# Altium schematic sheet UI_CCU_HAS.SchDoc: CCU - User Interface
size B; DrawnBy: M. Seago; Organization: Gravitas; Address1: Sponsored By:; Address2: Alan Morgan; Address3: Technical Advisor:; Address4: Dr. Joseph Morgan; Revision: 1A; SheetNumber: 3; SheetTotal: 9
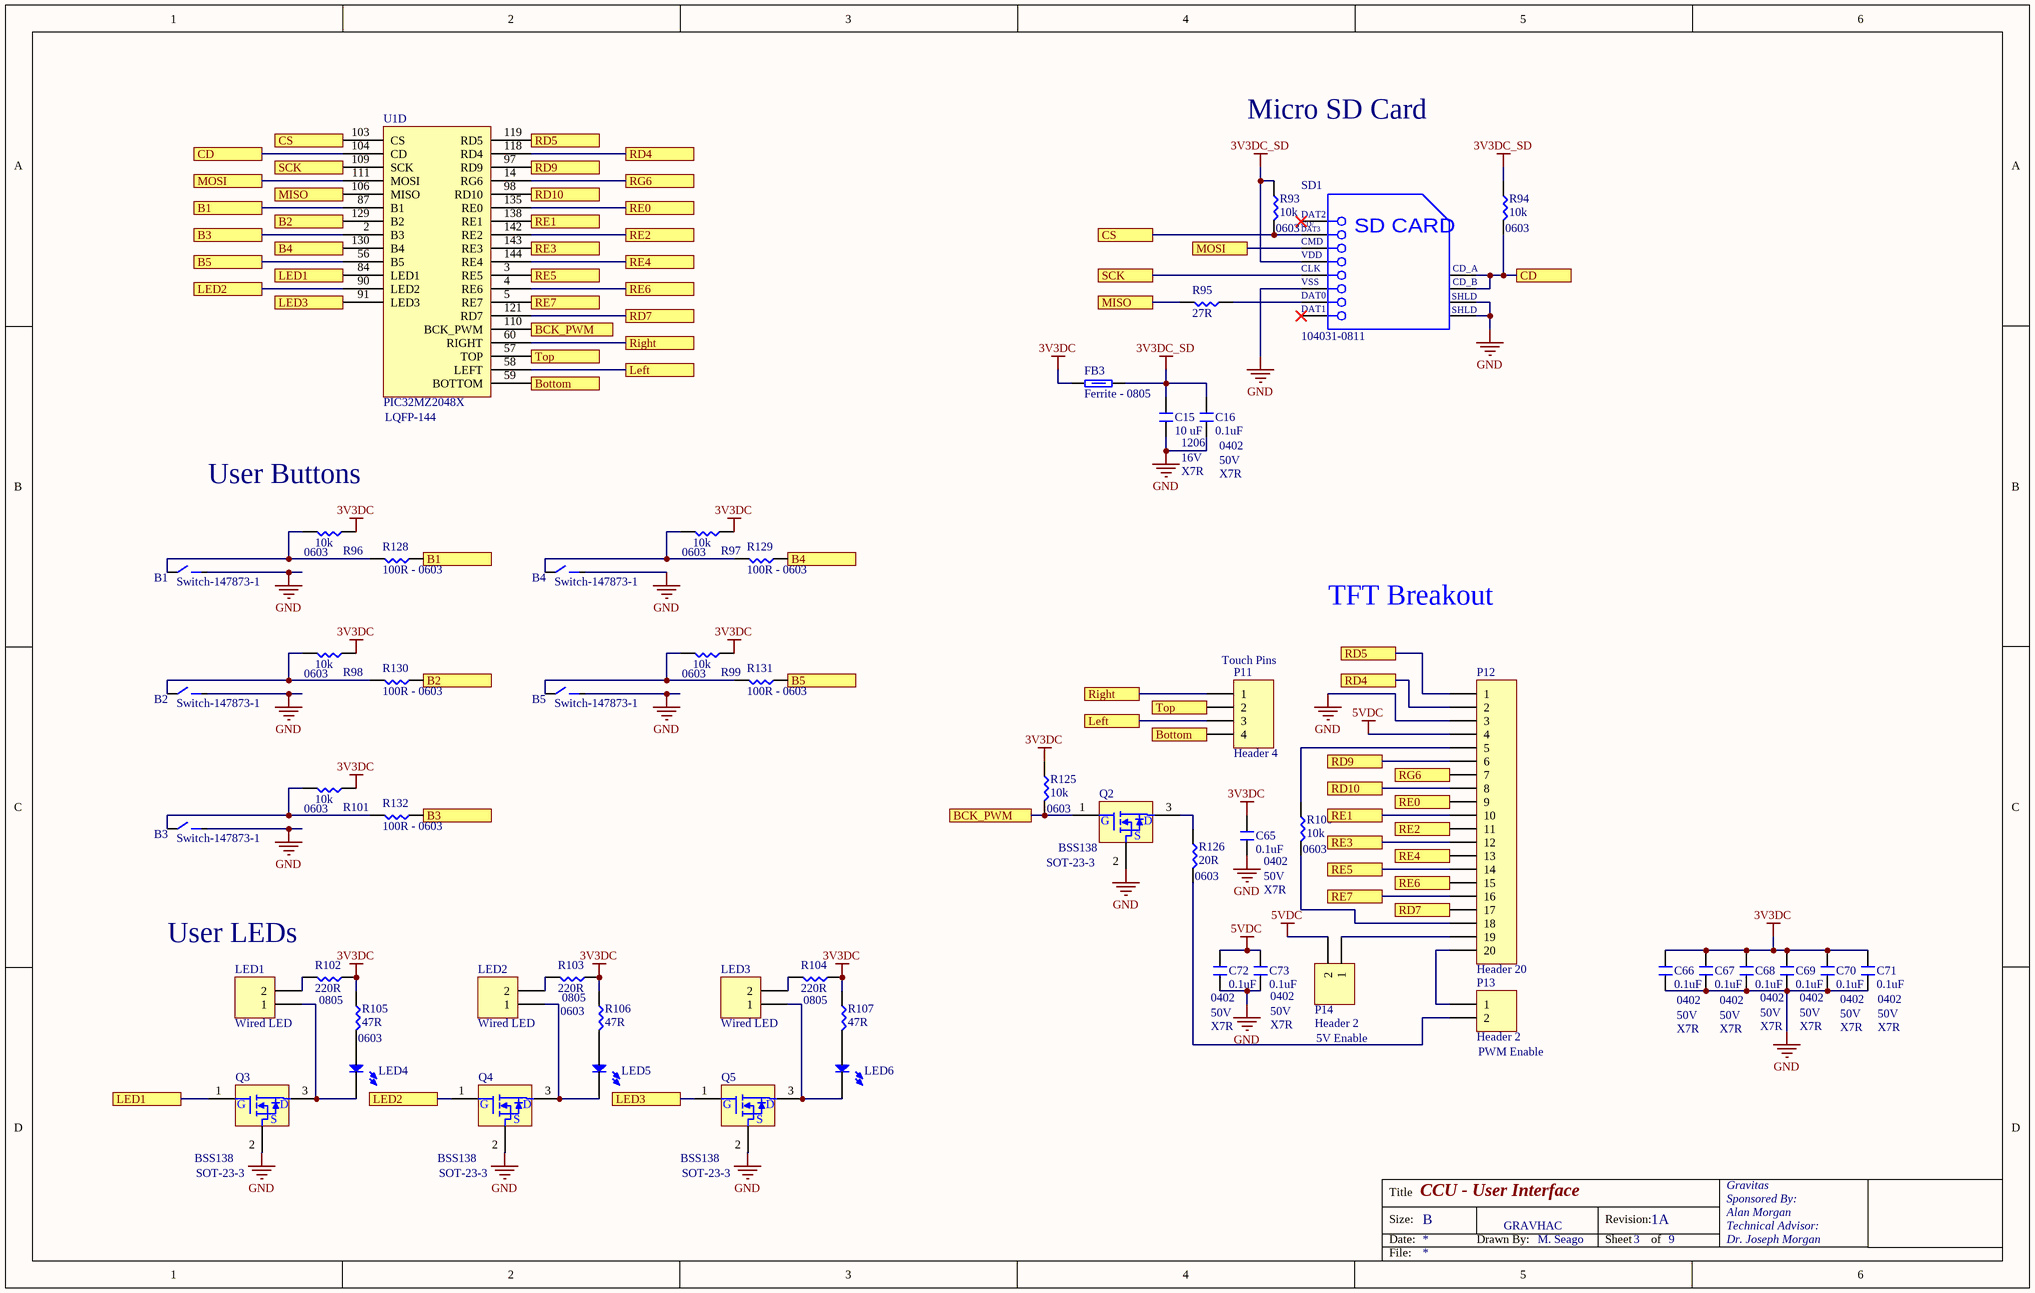
[diagram p0: UI_CCU_HAS.SchDoc]

## Parts
B1  Switch-147873-1  [Switch - 147873-1]
B2  Switch-147873-1  [Switch - 147873-1]
B3  Switch-147873-1  [Switch - 147873-1]
B4  Switch-147873-1  [Switch - 147873-1]
B5  Switch-147873-1  [Switch - 147873-1]
C15  10 uF  [NONPOLAR-1206]
C16  0.1uF  [NonPolar-0402]
C65  0.1uF  [NonPolar-0402]
C66  0.1uF  [NonPolar-0402]
C67  0.1uF  [NonPolar-0402]
C68  0.1uF  [NonPolar-0402]
C69  0.1uF  [NonPolar-0402]
C70  0.1uF  [NonPolar-0402]
C71  0.1uF  [NonPolar-0402]
C72  0.1uF  [NonPolar-0402]
C73  0.1uF  [NonPolar-0402]
FB3  Ferrite - 0805  [NonPolar-0805]
LED1  Wired LED  [HDR1X2]
LED2  Wired LED  [HDR1X2]
LED3  Wired LED  [HDR1X2]
LED4  LED-0603  [LED-0603]  (value not drawn)
LED5  LED-0603  [LED-0603]  (value not drawn)
LED6  LED-0603  [LED-0603]  (value not drawn)
P11  Header 4  [HDR1X4]
P12  Header 20  [HDR1X20]
P13  Header 2  [HDR1X2]
P14  Header 2  [HDR1X2]
Q2  BSS138  [BSS138-SOT23]
Q3  BSS138  [BSS138-SOT23]
Q4  BSS138  [BSS138-SOT23]
Q5  BSS138  [BSS138-SOT23]
R93  10k  [NonPolar-0603]
R94  10k  [NonPolar-0603]
R95  27R  [NonPolar-0603]
R96  10k  [NonPolar-0603]
R97  10k  [NonPolar-0603]
R98  10k  [NonPolar-0603]
R99  10k  [NonPolar-0603]
R100  10k  [NonPolar-0603]
R101  10k  [NonPolar-0603]
R102  220R  [NonPolar-0805]
R103  220R  [NonPolar-0805]
R104  220R  [NonPolar-0805]
R105  47R  [NonPolar-0603]
R106  47R  [NonPolar-0603]
R107  47R  [NonPolar-0603]
R125  10k  [NonPolar-0603]
R126  20R  [NonPolar-0603]
R128  100R - 0603  [NonPolar-0603]
R129  100R - 0603  [NonPolar-0603]
R130  100R - 0603  [NonPolar-0603]
R131  100R - 0603  [NonPolar-0603]
R132  100R - 0603  [NonPolar-0603]
SD1  104031-0811  [MOLX-104031-0811_V]
U1  PIC32MZ2048X  [BIG_PIC32MZ]  (part D of 7)

## Ports
B1, B2, B3, B4, B5, BCK_PWM, Bottom, CD, CS, LED1, LED2, LED3, Left, MISO, MOSI, RD4, RD5, RD7, RD9, RD10, RE0, RE1, RE2, RE3, RE4, RE5, RE6, RE7, RG6, Right, SCK, Top

## Nets
3V3DC: C65.2 C66.2 C67.2 C68.2 C69.2 C70.2 C71.2 FB3.1 R96.2 R97.2 R98.2 R99.2 R101.2 R102.2 R103.2 R104.2 R105.2 R106.2 R107.2 R125.2
3V3DC_SD: C15.2 C16.2 FB3.2 R93.2 R94.2 SD1.4(VDD)
5VDC: C72.2 C73.2 P12.4 P14.2
GND: B1.2 B2.2 B3.2 B4.2 B5.2 C15.1 C16.1 C65.1 C66.1 C67.1 C68.1 C69.1 C70.1 C71.1 C72.1 C73.1 P12.3 Q2.2(S) Q3.2(S) Q4.2(S) Q5.2(S) SD1.6(VSS2) SD1.11(SHLD1) SD1.12(SHLD2)
B1: R128.2 U1.87(B1) ; port B1
B2: R130.2 U1.129(B2) ; port B2
B3: R132.2 U1.2(B3) ; port B3
B4: R129.2 U1.130(B4) ; port B4
B5: R131.2 U1.56(B5) ; port B5
BCK_PWM: Q2.1(G) R125.1 U1.110(BCK_PWM) ; port BCK_PWM
Bottom: P11.4 U1.59(BOTTOM) ; port Bottom
CD: R94.1 SD1.9(CD_A) SD1.10(CD_B) U1.104(CD) ; port CD
CS: R93.1 SD1.2(CMD) U1.103(CS) ; port CS
LED1: Q3.1(G) U1.84(LED1) ; port LED1
LED2: Q4.1(G) U1.90(LED2) ; port LED2
LED3: Q5.1(G) U1.91(LED3) ; port LED3
Left: P11.3 U1.58(LEFT) ; port Left
MISO: R95.1 U1.106(MISO) ; port MISO
MOSI: SD1.3(VSS1) U1.111(MOSI) ; port MOSI
RD4: P12.2 U1.118(RD4) ; port RD4
RD5: P12.1 U1.119(RD5) ; port RD5
RD7: P12.17 U1.121(RD7) ; port RD7
RD9: P12.6 U1.97(RD9) ; port RD9
RD10: P12.8 U1.98(RD10) ; port RD10
RE0: P12.9 U1.135(RE0) ; port RE0
RE1: P12.10 U1.138(RE1) ; port RE1
RE2: P12.11 U1.142(RE2) ; port RE2
RE3: P12.12 U1.143(RE3) ; port RE3
RE4: P12.13 U1.144(RE4) ; port RE4
RE5: P12.14 U1.3(RE5) ; port RE5
RE6: P12.15 U1.4(RE6) ; port RE6
RE7: P12.16 U1.5(RE7) ; port RE7
RG6: P12.7 U1.14(RG6) ; port RG6
Right: P11.1 U1.60(RIGHT) ; port Right
SCK: SD1.5(CLK) U1.109(SCK) ; port SCK
Top: P11.2 U1.57(TOP) ; port Top
NetB1_1: B1.1 R96.1 R128.1
NetB2_1: B2.1 R98.1 R130.1
NetB3_1: B3.1 R101.1 R132.1
NetB4_1: B4.1 R97.1 R129.1
NetB5_1: B5.1 R99.1 R131.1
NetLED1_1: LED1.1 LED4.2 Q3.3(D)
NetLED1_2: LED1.2 R102.1
NetLED2_1: LED2.1 LED5.2 Q4.3(D)
NetLED2_2: LED2.2 R103.1
NetLED3_1: LED3.1 LED6.2 Q5.3(D)
NetLED3_2: LED3.2 R104.1
NetLED4_1: LED4.1 R105.1
NetLED5_1: LED5.1 R106.1
NetLED6_1: LED6.1 R107.1
NetP12_5: P12.5 R100.2
NetP12_18: P12.18 R100.1
NetP12_19: P12.19 P14.1
NetP12_20: P12.20 P13.1
NetP13_2: P13.2 R126.1
NetQ2_3: Q2.3(D) R126.2
NetR95_2: R95.2 SD1.7(DAT0)

Not connected (* = marked no-connect by the designer): SD1 1(CD/DAT3)* 8(DAT1)*

## Notes on the sheet
- Micro SD Card
- (near R93) 0603
- (near R94) 0603
- (near U1) LQFP-144
- (near R96) User Buttons
- 1206
- 16V
- X7R
- (near C16) 0402
- (near C16) 50V
- (near R96) 0603
- (near R97) 0603
- TFT Breakout
- (near R98) 0603
- (near R99) 0603
- (near P11) Touch Pins
- (near R101) 0603
- (near R125) 0603
- (near Q2) SOT-23-3
- (near R126) 0603
- 0402
- 50V
- (near R100) 0603
- User LEDs
- 0805
- (near R105) 0603
- (near R106) 0603
- (near C72) 0402
- (near C73) 0402
- (near C73) 50V
- 5V Enable
- (near C71) 0402
- (near C71) 50V
- (near P13) PWM Enable
- (near Q3) SOT-23-3
- (near Q4) SOT-23-3
- (near Q5) SOT-23-3
- GRAVHAC
- Title
- Size:
- Date:
- B
- Drawn By:
- Revision:
- Sheet
- of
- File:
- (in symbol CMP-2000-05825-1) DAT2; CD/; DAT3; SD CARD; VSS; SHLD

## Library data of the parts
C15 = Cap - 1206: CGA5L1X7R1E106K160AE
C16 C65-C73 = Cap - 0402
LED1-LED3 P13 P14 = Header 2: Header, 2-Pin; LatestRevisionDate: 17-Jul-2002; LatestRevisionNote: Re-released for DXP Platform.; Publisher: Altium Limited
P11 = Header 4: Header, 4-Pin; LatestRevisionDate: 17-Jul-2002; LatestRevisionNote: Re-released for DXP Platform.; Publisher: Altium Limited
P12 = Header 20: Header, 20-Pin; LatestRevisionDate: 17-Jul-2002; LatestRevisionNote: Re-released for DXP Platform.; Publisher: Altium Limited
R93-R101 R105-R107 R125 R126 R128-R132 = Res - 0603
R102-R104 = Res - 0805
SD1 = CMP-2000-05825-1: Micro SD Card, RA, -25 to 85 degC, 8-Pin SMD, RoHS, Tape and Reel; Voltage Rating: 10VAC/DC; Number of Contacts: 8; Insertion - Extraction Style: Push-Pull; Pitch: 1.1mm; Mating Cycles: 10000; Brand: Molex; Current Rating: 500mA; Manufacturer URL: http://www.molex.com/; Card Type: microSD; Mounting Type: Standard; Height: 1.42mm; Mounting Technology: SurfaceMount; Contact Plating: Gold; Product Category: MemoryCardConnectors; Package Description: 8-Pin Surface Mount Device, Body 11.95 x 11.4 mm, Pitch 1.1 mm; Datasheet URL: http://www.molex.com/pdm_docs/sd/1040310811_sd.pdf; Termination Style: SMD; Length: 11.4mm; Housing Material: LiquidCrystalPolymer(LCP); Orientation: RightAngle; RoHS: True; Contact Material: PhosphorBronze; Datasheet Version: Rev. E, 04/2006; Packaging: Reel; Manufacturer: Molex; Series: 104031; Product: CardConnectors; Number of Rows: 1Row; Package Reference: 104031-0811